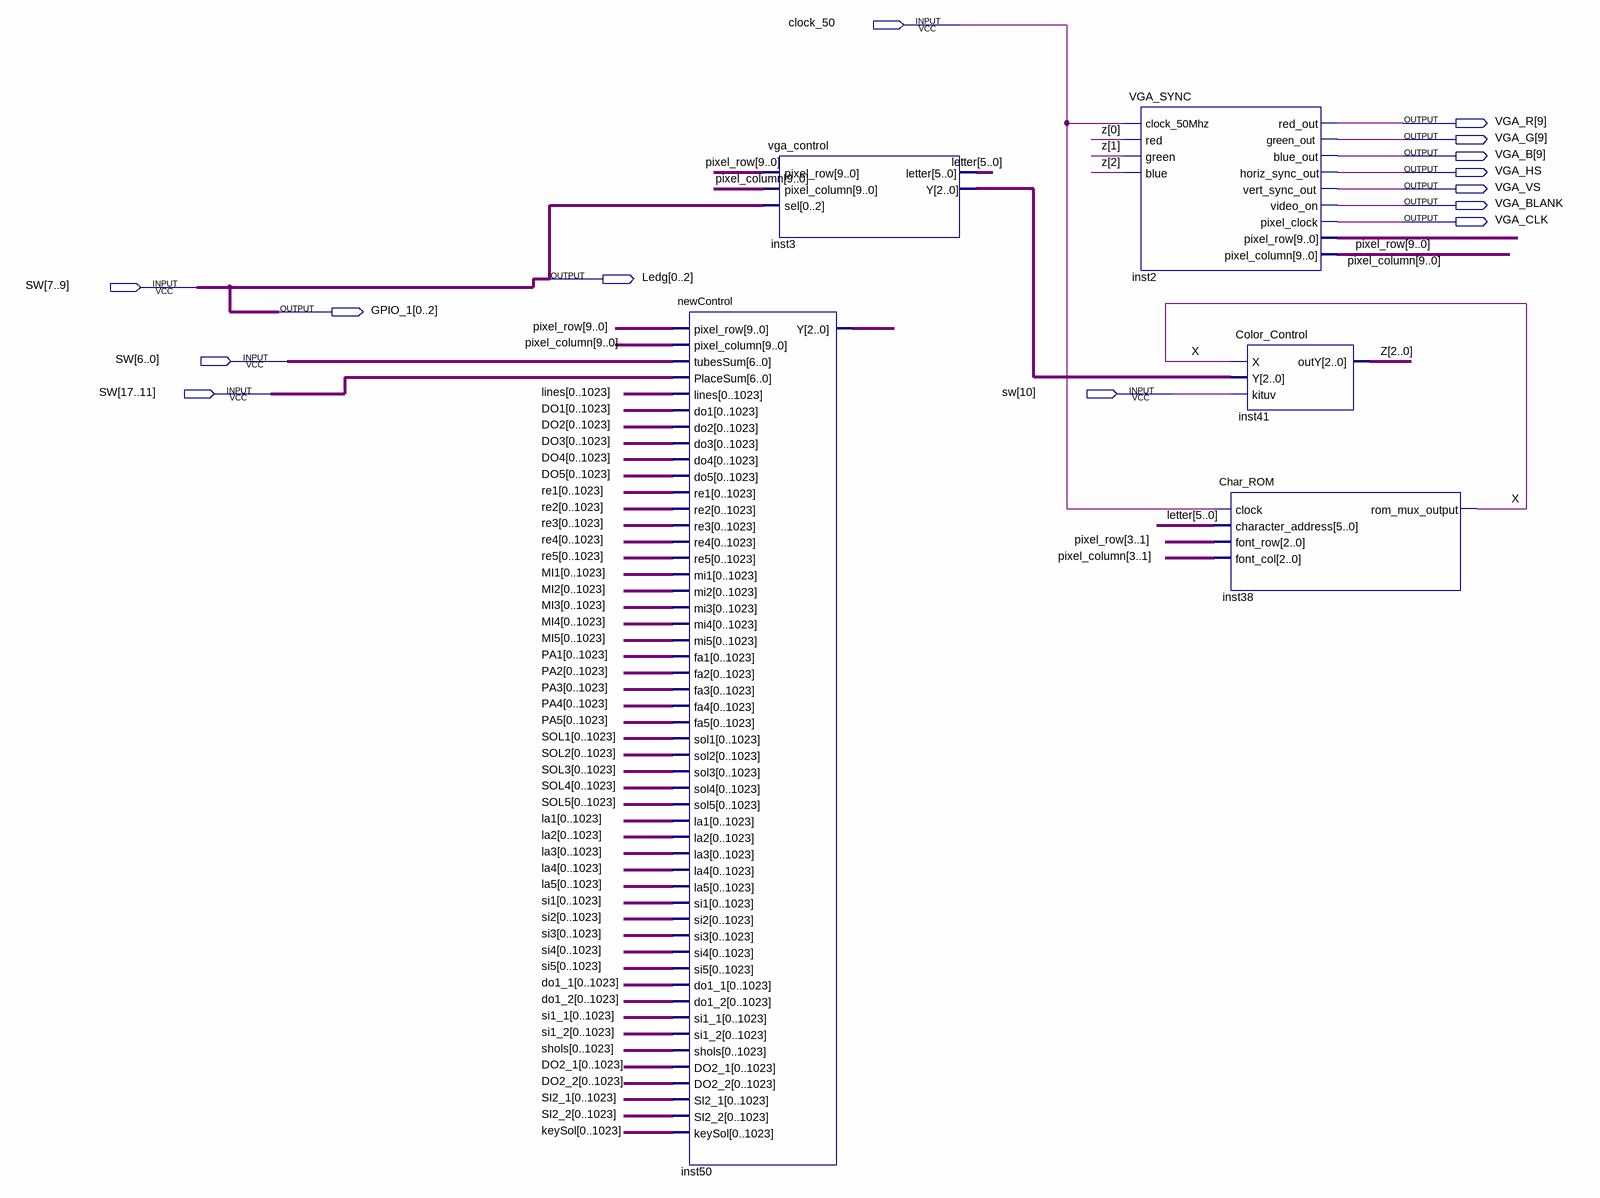
[diagram p0: schematic sheet]
// Quartus schematic Main_Project1.bdf as structural Verilog: 5 symbols, 14 pins
module Main_Project1 (
  input  clock_50,
  input  [0:17] SW,
  output [9:9] VGA_R,
  output [9:9] VGA_G,
  output [9:9] VGA_B,
  output VGA_HS,
  output VGA_VS,
  output VGA_BLANK,
  output VGA_CLK,
  output [0:2] Ledg,
  output [0:2] GPIO_1
);

  wire X;
  wire [2:0] inst3_y, inst50_y, Z;
  wire [5:0] letter;
  wire [9:0] pixel_column, pixel_row;
  wire [1023:0] DO1, do1_1, do1_2, DO2, DO2_1, DO2_2, DO3, DO4, DO5, keySol, la1, la2, la3, la4, la5, lines,
       MI1, MI2, MI3, MI4, MI5, PA1, PA2, PA3, PA4, PA5, re1, re2, re3, re4, re5, shols, si1, si1_1, si1_2,
       si2, SI2_1, SI2_2, si3, si4, si5, SOL1, SOL2, SOL3, SOL4, SOL5;
